# EAGLE design v1.4 (EAGLE 6.5.0)
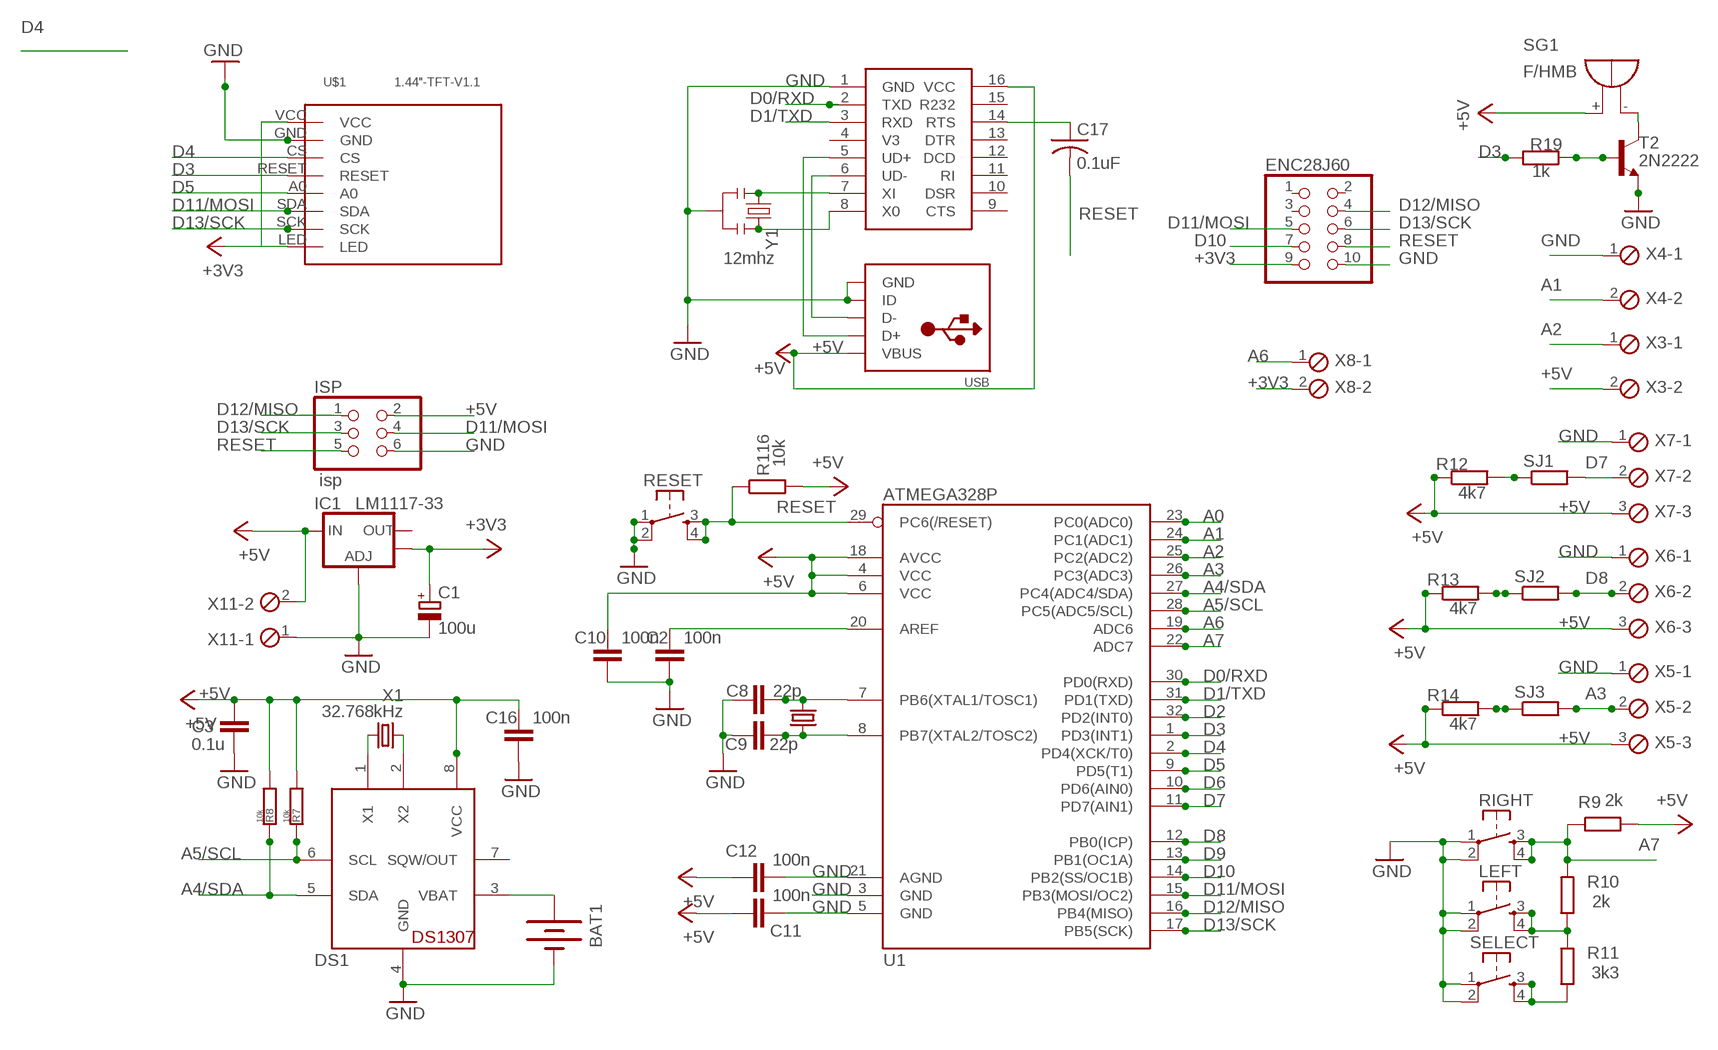
[diagram p0: schematic, sheet 1]

## Parts
BAT1  BATTERY20PTH  [BATTCOM_20MM_PTH]
C1  100u  CPOL-EUE2-5  [E2-5]
C2  100n  C-EUC0805  [C0805]
C3  0.1u  C-EUC0805  [C0805]
C8  22p  C-EUC0805  [C0805]
C9  22p  C-EUC0805  [C0805]
C10  100n  C-EUC0805  [C0805]
C11  100n  C-EUC0805  [C0805]
C12  100n  C-EUC0805  [C0805]
C16  100n  C-EUC0805  [C0805]
C17  0.1uF  C-USC0805K  [C0805K]
DS1  DS1307  DS1307SOIC  [SO08]
ENC28J60  PINHD-2X5  [2X05]
IC1  LM1117-33  V_REG_LM1117SOT223  [SOT223]
ISP  isp  PINHD-2X3  [2X03]
LEFT  TAC_SWITCHPTH  [TACTILE-PTH]
R7  10k  R-EU_R0805  [R0805]
R8  10k  R-EU_R0805  [R0805]
R9  2k  R-EU_R0805  [R0805]
R10  2k  R-EU_R0805  [R0805]
R11  3k3  R-EU_R0805  [R0805]
R12  4k7  R-EU_R0805  [R0805]
R13  4k7  R-EU_R0805  [R0805]
R14  4k7  R-EU_R0805  [R0805]
R19  1k  R-EU_R0805  [R0805]
R116  10k  R-EU_R0805  [R0805]
RESET  TAC_SWITCHPTH  [TACTILE-PTH]
RIGHT  TAC_SWITCHPTH  [TACTILE-PTH]
SELECT  TAC_SWITCHPTH  [TACTILE-PTH]
SG1  F/HMB  [F/HMB]
SJ1  R-EU_R0402  [R0402]
SJ2  R-EU_R0402  [R0402]
SJ3  R-EU_R0402  [R0402]
T2  2N2222  [TO92-EBC-OVAL]
U1  ATMEGA328P  ATMEGA328_SMT  [TQFP32-08]
U$1  1.44"-TFT-V1.1  [1.44-TFT-V1.1]
U$2  CH340G  [SO016]
USB  USBMOLEX  [USB-MINIB-THM-MOLEX]
X1  32.768kHz  CRYSTALTC26H  [TC26H]
X2  16MHz  CRYSTALHC49US  [HC49US]
X3  MPT2  [2POL254]
X4  MPT2  [2POL254]
X5  MPT3  [3POL254]
X6  MPT3  [3POL254]
X7  MPT3  [3POL254]
X8  MPT2  [2POL254]
X11  MPT2  [2POL254]
Y1  12mhz  RESONATORPTH  [RESONATOR-PTH]

## Nets
+3V3: C1.+ ENC28J60.9 IC1.4(OUT) U$1.LED U$1.VCC X8.2
+5V: C3.1 C10.1 C11.2 C12.2 C16.1 DS1.8(VCC) IC1.3(IN) ISP.2 R7.2 R8.2 R9.2 R12.1 R13.1 R14.1 R116.2 SG1.+ U1.4(VCC) U1.6(VCC) U1.18(AVCC) U$2.16(VCC) USB.VBUS X3.2 X5.3 X6.3 X7.3 X11.2
A0: U1.23(PC0(ADC0))
A1: U1.24(PC1(ADC1)) X4.2
A2: U1.25(PC2(ADC2)) X3.1
A3: SJ3.2 U1.26(PC3(ADC3)) X5.2
A4/SDA: DS1.5(SDA) R8.1 U1.27(PC4(ADC4/SDA))
A5/SCL: DS1.6(SCL) R7.1 U1.28(PC5(ADC5/SCL))
A6: U1.19(ADC6) X8.1
A7: R9.1 R10.2 RIGHT.3 RIGHT.4 U1.22(ADC7)
AREF: C2.1 U1.20(AREF)
D0/RXD: U1.30(PD0(RXD)) U$2.2(TXD)
D1/TXD: U1.31(PD1(TXD)) U$2.3(RXD)
D2: U1.32(PD2(INT0))
D3: R19.2 U1.1(PD3(INT1)) U$1.RESET
D4: U1.2(PD4(XCK/T0)) U$1.CS
D5: U1.9(PD5(T1)) U$1.A0
D6: U1.10(PD6(AIN0))
D7: SJ1.2 U1.11(PD7(AIN1)) X7.2
D8: SJ2.2 U1.12(PB0(ICP)) X6.2
D9: U1.13(PB1(OC1A))
D10: ENC28J60.7 U1.14(PB2(SS/OC1B))
D11/MOSI: ENC28J60.5 ISP.4 U1.15(PB3(MOSI/OC2)) U$1.SDA
D12/MISO: ENC28J60.4 ISP.1 U1.16(PB4(MISO))
D13/SCK: ENC28J60.6 ISP.3 U1.17(PB5(SCK)) U$1.SCK
GND: BAT1.2(-) C1.- C2.2 C3.2 C8.1 C9.1 C10.2 C11.1 C12.1 C16.2 DS1.4(GND) ENC28J60.10 IC1.1(ADJ) ISP.6 LEFT.1 LEFT.2 RESET.1 RESET.2 RIGHT.1 RIGHT.2 SELECT.1 SELECT.2 T2.E U1.3(GND) U1.5(GND) U1.21(AGND) U$1.GND U$2.1(GND) USB.GND USB.ID X4.1 X5.1 X6.1 X7.1 X11.1 Y1.2
N$1: LEFT.3 LEFT.4 R10.1 R11.2
N$7: BAT1.1(+) DS1.3(VBAT)
N$8: DS1.1(X1) X1.2
N$10: U$2.7(XI) Y1.1
N$11: U$2.6(UD-) USB.D-
N$15: U$2.5(UD+) USB.D+
N$17: R13.2 SJ2.1
N$18: R11.1 SELECT.3 SELECT.4
N$27: R19.1 T2.B
N$28: R14.2 SJ3.1
N$29: SG1.- T2.C
N$30: DS1.2(X2) X1.1
N$31: R12.2 SJ1.1
N$32: C9.2 U1.8(PB7(XTAL2/TOSC2)) X2.1
N$33: C8.2 U1.7(PB6(XTAL1/TOSC1)) X2.2
N$40: U$2.8(X0) Y1.3
N$43: C17.1 U$2.14(RTS)
RESET: C17.2 ENC28J60.8 ISP.5 R116.1 RESET.3 RESET.4 U1.29(PC6(/RESET))
Unconnected: DS1.7(SQW/OUT) ENC28J60.1 ENC28J60.2 ENC28J60.3 IC1.2(OUT) U$2.4(V3) U$2.9(CTS) U$2.10(DSR) U$2.11(RI) U$2.12(DCD) U$2.13(DTR) U$2.15(R232)

## Library data of the parts
BAT1 = SparkFun-Electromechanical:BATTERY: Battery Holders Various common sizes : AA, AAA, 20mm coin cell and 12mm coin cell. 20MM_4LEGS, BATT-10373
C1 = resistor:CPOL-EU: POLARIZED CAPACITOR, European symbol
C2 C8-C12 C16 = resistor:C-EU: CAPACITOR, European symbol
C3 = rcl:C-EU: CAPACITOR, European symbol
C17 = rcl:C-US: CAPACITOR, American symbol
DS1 = adafruit:DS1307: DS1307 Real time clock (RTC) with battery backup ability. Talk to it via i2c
ENC28J60 = pinhead:PINHD-2X5: PIN HEADER
IC1 = SparkFun:V_REG_LM1117: Voltage Regulator LM1117 Standard adjustable voltage regulator but in SMD form. Spark Fun Electronics SKU : COM-00595
ISP = pinhead:PINHD-2X3: PIN HEADER
LEFT RESET RIGHT SELECT = SparkFun-Electromechanical:TAC_SWITCH: Momentary Switch Button commonly used for reset or general input. Spark Fun Electronics SKU : COM-00097 SMT- SWCH-08247
R7-R14 R19 R116 SJ1-SJ3 = rcl:R-EU_: RESISTOR, European symbol
SG1 = buzzer:F/HMB: BUZZER Source: Buerklin; OC_FARNELL: unknown; OC_NEWARK: unknown
T2 = adafruit:2N2222: NPN TRANSISTOR Big oval pads
U1 = SparkFun-DigitalIC:ATMEGA328_SMT: 32-Pin Atmega328 part Commonly used on Arduino compatible boards Available in QFP and QFN packages TQFP is IC-09069 QFN is non-stock; PROD_ID: IC-09069
U$1 = tft_1.8:1.44"-TFT-V1.1
U$2 = ch340:CH340G: CH340G
USB = adafruit:USB: USB Connectors USBMINIB - Surface Mount Female Mini-B USB Connector 4UConnector: 06564 By microbuilder.eu Thru-hole RA Female Mini-B USB Connector 4UConnector: 18732 By ladyada.net
X1 = crystal:CRYSTAL: CRYSTAL; OC_FARNELL: unknown; OC_NEWARK: unknown
X2 = SparkFun:CRYSTAL: Crystals Various standard crystals. Proven footprints. Spark Fun Electronics SKU : COM-00534
X3 X4 X8 X11 = con-phoenix-254:MPT2: PHOENIX CONNECTOR; OC_FARNELL: unknown; OC_NEWARK: unknown
X5-X7 = con-phoenix-254:MPT3: PHOENIX CONNECTOR; OC_FARNELL: unknown; OC_NEWARK: unknown
Y1 = SparkFun-FreqCtrl:RESONATOR: Resonator Small SMD resonator. Used, eg, on the Arduino Pro/ Pro Mini boards. 8MHz- XTAL-08895 16MHz- XTAL-08900

## Net classes
0 default: width 0.178 mm, clearance 0.205 mm
1 power: width 0.203 mm, clearance 0.203 mm
2 GND: width 0.203 mm
3 signal: width 0.178 mm, clearance 0.205 mm to class 0, clearance 0.205 mm to class 1, clearance 0.205 mm to class 2, clearance 0.205 mm

## Board
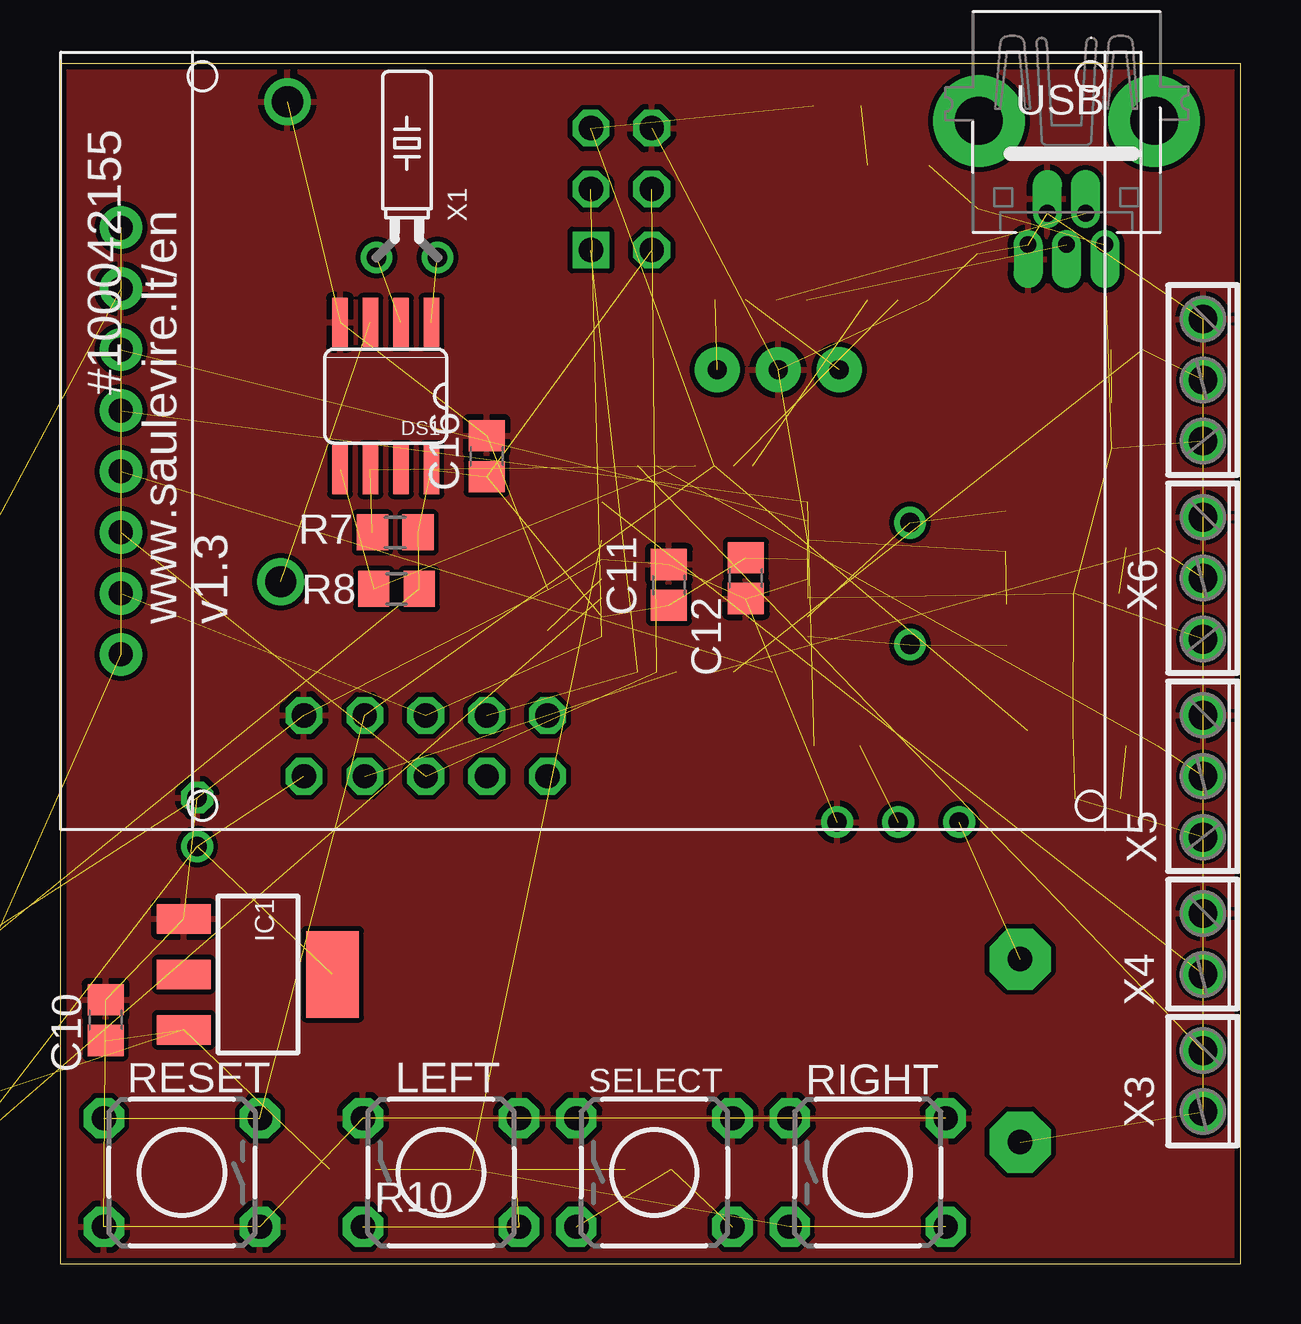
[diagram p1: board, top side]
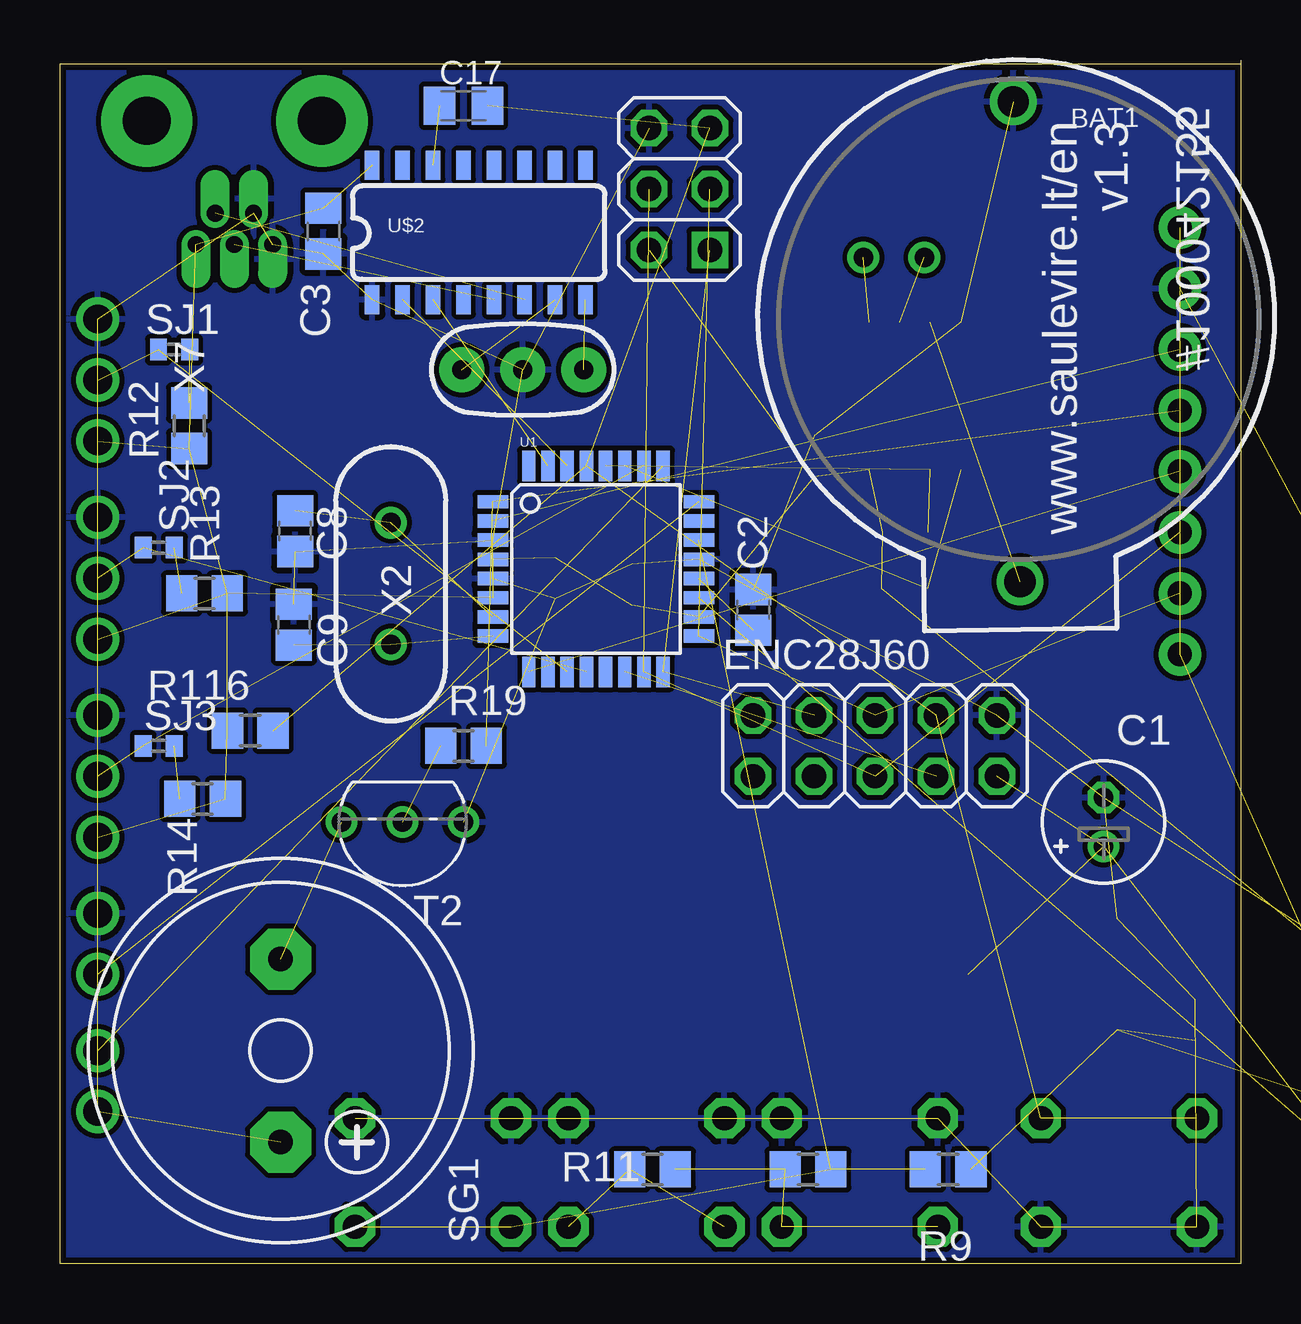
[diagram p2: board, bottom side, seen from below]

Size 49.2 x 50.16 mm. Coordinates in mm from the lower left corner, seen from the top.
Outline: 0,50 49.2,50 49.2,0 0,0 0,50.16
Copper layers (1*16): Top 0.035mm / dielectric 1.5mm / Bottom 0.035mm
Design rules "ITEADstudio_DRC": minimum track width 6mil, minimum drill 12mil, track to track 6mil, track to pad 6mil, pad to pad 6mil, via to via 6mil, smd to smd 0mil, copper to edge 10mil, drill to drill 10mil, minimum pad ring 10mil, minimum via ring 6mil, stop-mask expansion 2mil, vias tented up to drill 100mil, thermal gap 10mil
vRestrict: area 32,73 to 71,78

### Footprints (pad centres in the part's own frame; a part is rotated, then mirrored left to right if it is on the bottom)
BATTCOM_20MM_PTH = drill 1.3: 1 20,0; 2 0,0
E2-5 = drill 0.813 pad 1.27: + -1.016,0 | drill 0.813 pad 1.27 octagon: - 1.016,0
C0805 = smd 1.3 x 1.5: 1 -0.85,0; 2 0.85,0
C0805' = smd 1.3 x 1.5: 1 -0.95,0; 2 0.95,0
C0805K = smd 1.3 x 1.6: 1 -1,0; 2 1,0
SO08 = smd 0.66 x 2.032: 1 -1.905,-3.073; 2 -0.635,-3.073; 3 0.635,-3.073; 4 1.905,-3.073; 5 1.905,3.073; 6 0.635,3.073; 7 -0.635,3.073; 8 -1.905,3.073
2X05 = drill 1.016 octagon: 1 -5.08,-1.27; 2 -5.08,1.27; 3 -2.54,-1.27; 4 -2.54,1.27; 5 0,-1.27; 6 0,1.27; 7 2.54,-1.27; 8 2.54,1.27; 9 5.08,-1.27; 10 5.08,1.27
SOT223 = smd 1.219 x 2.235: 1 -2.311,-3.099; 2 0,-3.099; 3 2.311,-3.099 | smd 3.6 x 2.2: 4 0,3.099
2X03 = drill 1.016 square: 1 -2.54,-1.27 | drill 1.016 octagon: 2 -2.54,1.27; 3 0,-1.27; 4 0,1.27; 5 2.54,-1.27; 6 2.54,1.27
TACTILE-PTH = drill 1.016 pad 1.676 octagon: 1 -3.251,2.261; 2 3.251,2.261; 3 -3.251,-2.261; 4 3.251,-2.261
R0805 = smd 1.3 x 1.5: 1 -0.95,0; 2 0.95,0
F/HMB = drill 1.016 pad 2.54 octagon: + 3.81,0; - -3.81,0
R0402 = smd 0.7 x 0.9: 1 -0.65,0; 2 0.65,0
TO92-EBC-OVAL = drill 0.813: B 0,-1.27; C 2.54,-1.27; E -2.54,-1.27
TQFP32-08 = smd 1.27 x 0.559: 1 -4.293,2.8; 2 -4.293,2; 3 -4.293,1.2; 4 -4.293,0.4; 5 -4.293,-0.4; 6 -4.293,-1.2; 7 -4.293,-2; 8 -4.293,-2.8; 17 4.293,-2.8; 18 4.293,-2; 19 4.293,-1.2; 20 4.293,-0.4; 21 4.293,0.4; 22 4.293,1.2; 23 4.293,2; 24 4.293,2.8 | smd 0.559 x 1.27: 9 -2.8,-4.293; 10 -2,-4.293; 11 -1.2,-4.293; 12 -0.4,-4.293; 13 0.4,-4.293; 14 1.2,-4.293; 15 2,-4.293; 16 2.8,-4.293; 25 2.8,4.293; 26 2,4.293; 27 1.2,4.293; 28 0.4,4.293; 29 -0.4,4.293; 30 -1.2,4.293; 31 -2,4.293; 32 -2.8,4.293
1.44-TFT-V1.1 = drill 1 pad 1.778: A0 0,7.62; CS 0,12.7; GND 0,15.24; LED 0,0; RESET 0,10.16; SCK 0,2.54; SDA 0,5.08; VCC 0,17.78
SO016 = smd 0.6 x 1.2: 1 -4.445,-2.8; 2 -3.175,-2.8; 3 -1.905,-2.8; 4 -0.635,-2.8; 5 0.635,-2.8; 6 1.905,-2.8; 7 3.175,-2.8; 8 4.445,-2.8; 9 4.445,2.8; 10 3.175,2.8; 11 1.905,2.8; 12 0.635,2.8; 13 -0.635,2.8; 14 -1.905,2.8; 15 -3.175,2.8; 16 -4.445,2.8
USB-MINIB-THM-MOLEX = drill 0.7 offset: D+ 0,9.72; D- -0.8,8.42; GND 1.6,9.72; ID 0.8,8.42; VBUS -1.6,9.72 | drill 2 pad 3.81: GND1 -3.65,4.57; GND4 3.65,4.57
TC26H = drill 0.813: 1 -1.27,0; 2 1.27,0
HC49US = drill 0.813: 1 -2.54,0; 2 2.54,0
2POL254 = drill 1.2: 1 -1.27,0; 2 1.27,0
3POL254 = drill 1.2: 1 -2.54,0; 2 0,0; 3 2.54,0
RESONATOR-PTH = drill 0.8 pad 1.88: 1 -2.54,0; 2 0,0; 3 2.54,0

### Placement (x,y rotation side)
BAT1  9.48,48.42 270.8 bottom
C1  5.71,18.41 90 bottom
C2  20.32,27.25 90 bottom
C3  0.1u  [C0805']  38.22,43.04 270 bottom
C8  39.41,30.54 90 bottom
C9  39.45,26.64 270 bottom
C10  1.91,10.16 90 top
C11  25.37,28.3 270 top
C12  28.57,28.57 90 top
C16  17.78,33.66 90 top
C17  32.38,48.26 0 bottom
DS1  13.57,36.16 180 top
ENC28J60  15.24,21.59 0 bottom
IC1  8.26,12.06 270 top
ISP  23.39,44.79 90 bottom
LEFT  15.88,3.81 0 top
R7  13.97,30.48 0 top
R8  14.02,28.13 0 top
R9  12.19,3.94 0 bottom
R10  18.03,3.94 0 bottom
R11  24.51,3.94 0 bottom
R12  43.81,34.92 90 bottom
R13  43.18,27.94 180 bottom
R14  43.26,19.38 180 bottom
R19  32.38,21.59 0 bottom
R116  41.27,22.23 180 bottom
RESET  5.08,3.81 180 top
RIGHT  33.66,3.81 0 top
SELECT  24.77,3.81 0 top
SG1  40.01,8.89 270 bottom
SJ1  44.45,38.1 180 bottom
SJ2  45.09,29.84 180 bottom
SJ3  45.09,21.59 180 bottom
T2  34.92,17.14 180 bottom
U1  26.87,28.96 0 bottom
U$1  2.54,25.4 0 top
U$2  31.75,42.98 0 bottom
USB  41.94,52.2 180 top
X1  14.46,41.94 0 top
X2  35.41,28.34 90 bottom
X3  47.62,7.62 270 top
X4  47.62,13.34 270 top
X5  47.62,20.32 270 top
X6  47.62,28.57 270 top
X7  47.62,36.83 270 top
X8  -10.16,-1.91 270 bottom  (outside the outline)
X11  -16.51,3.81 270 bottom  (outside the outline)
Y1  29.92,37.26 0 bottom

### Tracks (layer width: path | path; a pad name or v marks a point on that pad's centre or on a via)
+3V3  (5 unrouted)
+5V  (25 unrouted)
A1  (1 unrouted)
A2  (1 unrouted)
A3  (2 unrouted)
A4/SDA  (2 unrouted)
A5/SCL  (2 unrouted)
A6  (1 unrouted)
A7  (4 unrouted)
AREF  (1 unrouted)
D0/RXD  (1 unrouted)
D1/TXD  (1 unrouted)
D3  (2 unrouted)
D4  (1 unrouted)
D5  (1 unrouted)
D7  (2 unrouted)
D8  (2 unrouted)
D10  (1 unrouted)
D11/MOSI  (3 unrouted)
D12/MISO  (2 unrouted)
D13/SCK  (3 unrouted)
GND  (35 unrouted)
  pour Bottom: 0,50.16 48.9,50.16 48.9,0 0,0
  pour Top: 0.64,50.16 48.9,50.16 48.9,0 0,0 0,50.16
N$1  (3 unrouted)
N$7  (1 unrouted)
N$8  (1 unrouted)
N$10  (1 unrouted)
N$11  (1 unrouted)
N$15  (1 unrouted)
N$17  (1 unrouted)
N$18  (2 unrouted)
N$27  (1 unrouted)
N$28  (1 unrouted)
N$29  (1 unrouted)
N$30  (1 unrouted)
N$31  (1 unrouted)
N$32  (2 unrouted)
N$33  (2 unrouted)
N$40  (1 unrouted)
N$43  (1 unrouted)
RESET  (6 unrouted)

### Text on the board
tNames: #100042155 | www.saulevire.lt/en / v1.3
bNames: #100042155 | www.saulevire.lt/en / v1.3
BoxDim: Serpac WM-032C Enclosure | All units are in inch | Left | Right | Front | Bottom